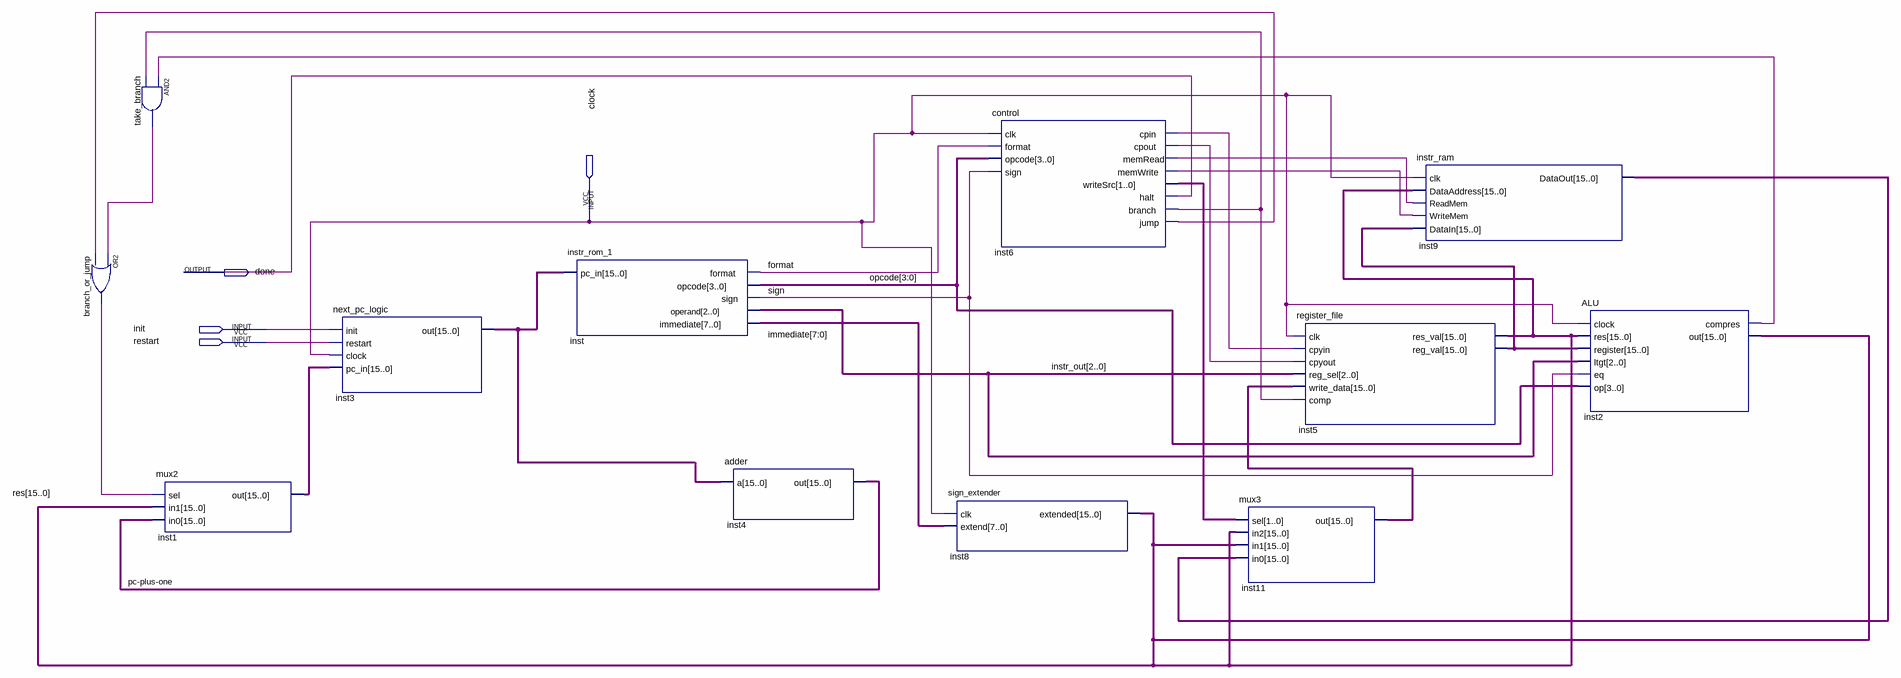
[diagram p0: schematic sheet]
// Quartus schematic processor_d.bdf as structural Verilog: 12 symbols, 4 pins
module processor_d (
  input  clock,
  input  init,
  input  restart,
  output done
);

  wire branch_or_jump_out, format, inst2_compres, inst6_branch, inst6_cpin, inst6_cpout, inst6_jump,
       inst6_memread, inst6_memwrite, \pc-plus-one , sign, take_branch_out;
  wire [1:0] inst6_writesrc;
  wire [2:0] instr_out;
  wire [3:0] opcode;
  wire [7:0] immediate;
  wire [15:0] inst1_out, inst3_out, inst5_reg_val, inst9_dataout, inst11_out, res;

  or branch_or_jump (branch_or_jump_out, take_branch_out, inst6_jump);
  and take_branch (take_branch_out, inst2_compres, inst6_branch);
  mux2 inst1 (.sel(branch_or_jump_out), .in1(res), .in0({16{\pc-plus-one }}), .out(inst1_out));
  next_pc_logic inst3 (.init(init), .restart(restart), .clock(clock), .pc_in(inst1_out), .out(inst3_out));
  instr_rom_1 inst (
    .pc_in(inst3_out), .format(format), .opcode(opcode), .sign(sign), .operand(instr_out),
    .immediate(immediate));
  adder inst4 (.a(inst3_out), .out(\pc-plus-one ));
  sign_extender inst8 (.clk(clock), .extend(immediate), .extended(res));
  control inst6 (
    .clk(clock), .format(format), .opcode(opcode), .sign(sign), .cpin(inst6_cpin), .cpout(inst6_cpout),
    .memRead(inst6_memread), .memWrite(inst6_memwrite), .writeSrc(inst6_writesrc), .halt(done),
    .branch(inst6_branch), .jump(inst6_jump));
  mux3 inst11 (.sel(inst6_writesrc), .in2(res), .in1(res), .in0(inst9_dataout), .out(inst11_out));
  register_file inst5 (
    .clk(clock), .cpyin(inst6_cpin), .cpyout(inst6_cpout), .reg_sel(instr_out), .write_data(inst11_out),
    .comp(inst6_branch), .res_val(res), .reg_val(inst5_reg_val));
  instr_ram inst9 (
    .clk(clock), .DataAddress(res), .ReadMem(inst6_memread), .WriteMem(inst6_memwrite),
    .DataIn(inst5_reg_val), .DataOut(inst9_dataout));
  ALU inst2 (
    .clock(clock), .res(res), .register(inst5_reg_val), .ltgt(instr_out), .eq(sign), .op(opcode),
    .compres(inst2_compres), .out(res));
endmodule
